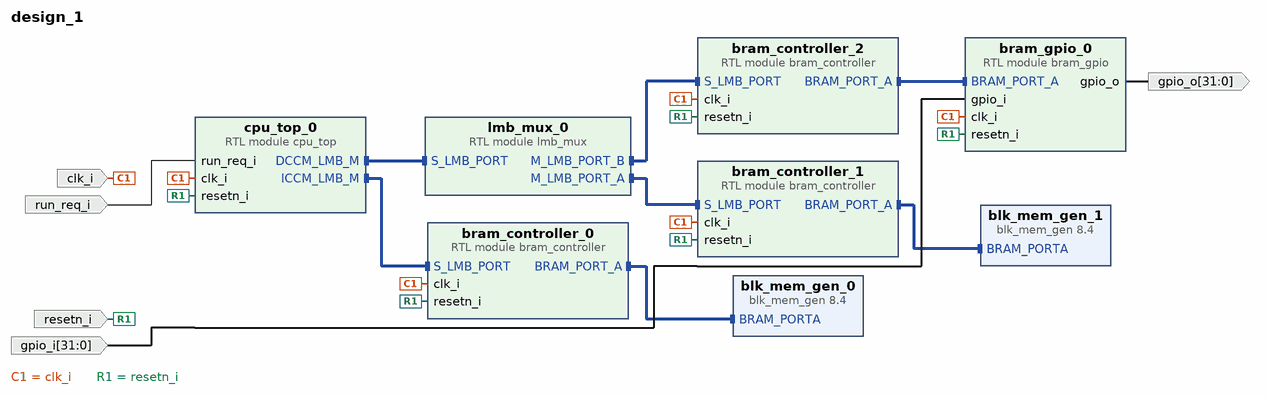
[diagram p0: block diagram of the top level]
# Vivado block design design_1, xc7a200tfbg484-2, Vivado 2023.2
create_bd_design design_1

create_bd_port -dir I clk_i
create_bd_port -dir I resetn_i
create_bd_port -dir I run_req_i
create_bd_port -dir O -from 31 -to 0 gpio_o
create_bd_port -dir I -from 31 -to 0 gpio_i

create_bd_cell -type module -reference cpu_top cpu_top_0
create_bd_cell -type module -reference bram_controller bram_controller_0
set_property -dict {CONFIG.BASE_ADDR 4096 CONFIG.WORD_ADDR_W 13} [get_bd_cells bram_controller_0]
create_bd_cell -type ip -vlnv xilinx.com:ip:blk_mem_gen:8.4 blk_mem_gen_0
set_property -dict [list \
  CONFIG.Byte_Size 8 \
  CONFIG.Read_Width_A 32 \
  CONFIG.Register_PortA_Output_of_Memory_Primitives false \
  CONFIG.Use_Byte_Write_Enable true \
  CONFIG.Write_Width_A 32 \
  CONFIG.use_bram_block Stand_Alone \
] [get_bd_cells blk_mem_gen_0]
create_bd_cell -type module -reference bram_controller bram_controller_1
set_property -dict {CONFIG.BASE_ADDR 36864 CONFIG.WORD_ADDR_W 13} [get_bd_cells bram_controller_1]
create_bd_cell -type ip -vlnv xilinx.com:ip:blk_mem_gen:8.4 blk_mem_gen_1
set_property -dict [list \
  CONFIG.Byte_Size 8 \
  CONFIG.Read_Width_A 32 \
  CONFIG.Register_PortA_Output_of_Memory_Primitives false \
  CONFIG.Use_Byte_Write_Enable true \
  CONFIG.Write_Width_A 32 \
  CONFIG.use_bram_block Stand_Alone \
] [get_bd_cells blk_mem_gen_1]
create_bd_cell -type module -reference lmb_mux lmb_mux_0
set_property -dict [list \
  CONFIG.PORTA_ADDR_BASE 36864 \
  CONFIG.PORTA_ADDR_HIGH 69632 \
  CONFIG.PORTB_ADDR_BASE 73728 \
  CONFIG.PORTB_ADDR_HIGH 73856 \
] [get_bd_cells lmb_mux_0]
create_bd_cell -type module -reference bram_controller bram_controller_2
set_property -dict {CONFIG.BASE_ADDR 73728 CONFIG.WORD_ADDR_W 5} [get_bd_cells bram_controller_2]
create_bd_cell -type module -reference bram_gpio bram_gpio_0

# ---- connections ----

connect_bd_intf_net [get_bd_intf_pins bram_controller_0/BRAM_PORT_A] [get_bd_intf_pins blk_mem_gen_0/BRAM_PORTA]
connect_bd_intf_net [get_bd_intf_pins bram_controller_1/BRAM_PORT_A] [get_bd_intf_pins blk_mem_gen_1/BRAM_PORTA]
connect_bd_intf_net [get_bd_intf_pins bram_controller_2/BRAM_PORT_A] [get_bd_intf_pins bram_gpio_0/BRAM_PORT_A]
connect_bd_intf_net [get_bd_intf_pins cpu_top_0/DCCM_LMB_M] [get_bd_intf_pins lmb_mux_0/S_LMB_PORT]
connect_bd_intf_net [get_bd_intf_pins cpu_top_0/ICCM_LMB_M] [get_bd_intf_pins bram_controller_0/S_LMB_PORT]
connect_bd_intf_net [get_bd_intf_pins lmb_mux_0/M_LMB_PORT_A] [get_bd_intf_pins bram_controller_1/S_LMB_PORT]
connect_bd_intf_net [get_bd_intf_pins lmb_mux_0/M_LMB_PORT_B] [get_bd_intf_pins bram_controller_2/S_LMB_PORT]
connect_bd_net [get_bd_pins bram_gpio_0/gpio_o] [get_bd_ports gpio_o]
connect_bd_net -net clk_i_0_1 [get_bd_ports clk_i] \
  [get_bd_pins cpu_top_0/clk_i] [get_bd_pins bram_controller_0/clk_i] [get_bd_pins bram_controller_1/clk_i] \
  [get_bd_pins bram_controller_2/clk_i] [get_bd_pins bram_gpio_0/clk_i]
connect_bd_net -net gpio_i_0_1 [get_bd_ports gpio_i] [get_bd_pins bram_gpio_0/gpio_i]
connect_bd_net -net resetn_i_0_1 [get_bd_ports resetn_i] \
  [get_bd_pins cpu_top_0/resetn_i] [get_bd_pins bram_controller_0/resetn_i] [get_bd_pins bram_controller_1/resetn_i] \
  [get_bd_pins bram_controller_2/resetn_i] [get_bd_pins bram_gpio_0/resetn_i]
connect_bd_net -net run_req_i_0_1 [get_bd_ports run_req_i] [get_bd_pins cpu_top_0/run_req_i]

validate_bd_design
save_bd_design
